# Altium project PCB_Project2.PrjPCB
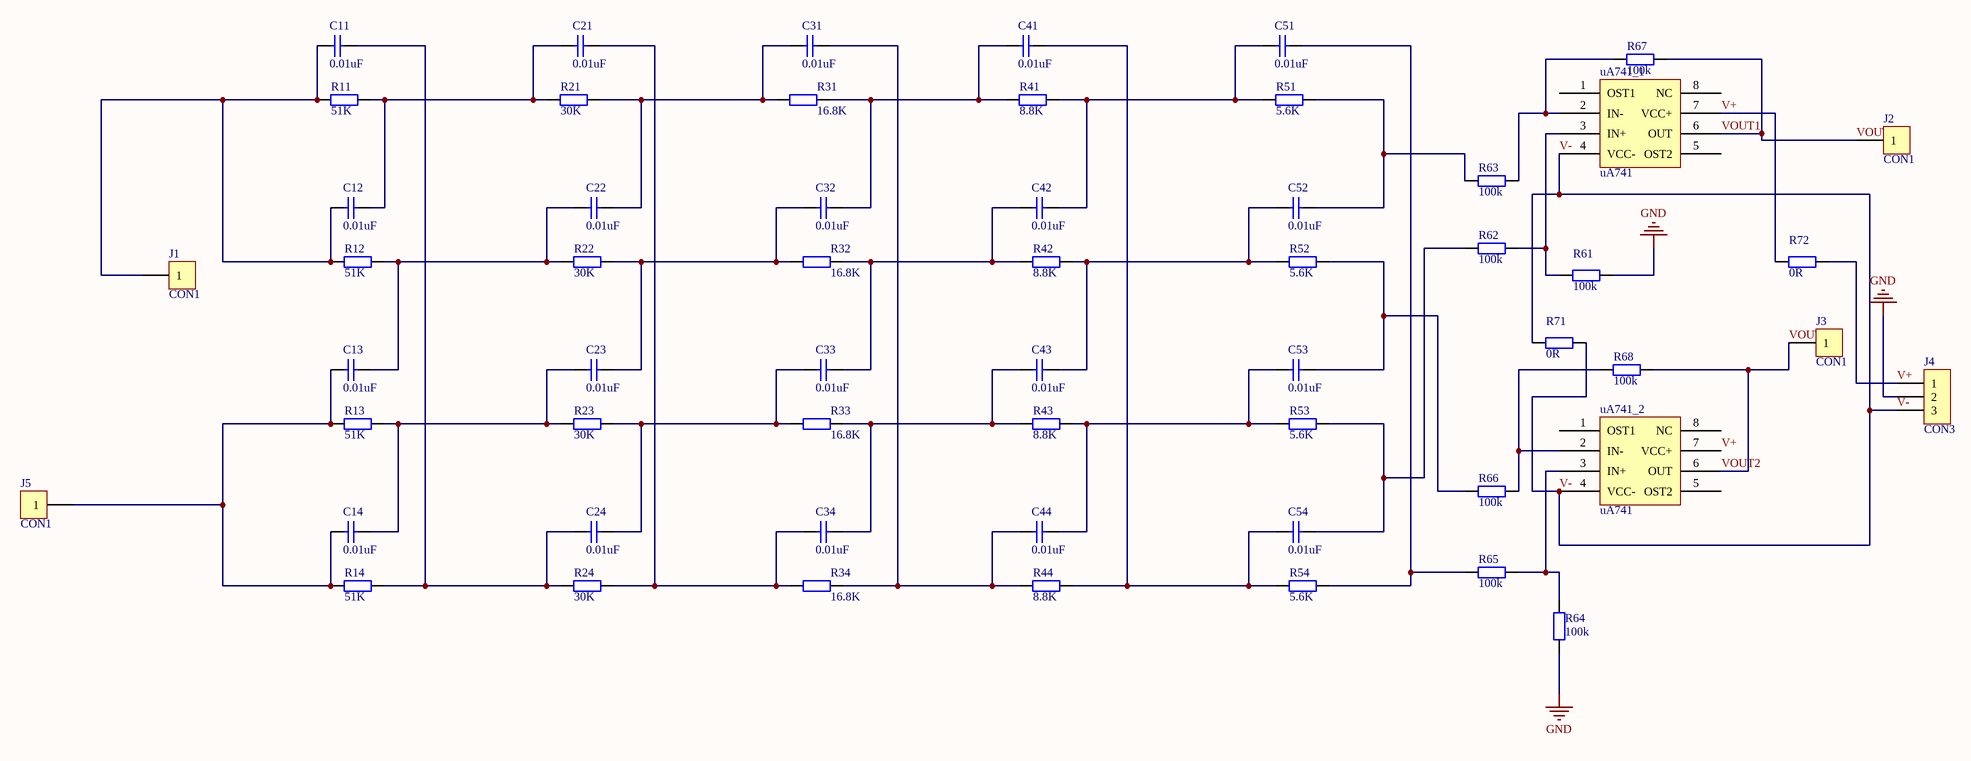
[diagram p0: Sheet1.SchDoc]
1 sheet, 57 parts. Net scope: global (net labels, ports and power ports of the same name join across sheets).
Board file: PCB1.PcbDoc

## Sheet Sheet1.SchDoc
size A3

### Parts
C11  0.01uF  [0603C]
C12  0.01uF  [0603C]
C13  0.01uF  [0603C]
C14  0.01uF  [0603C]
C21  0.01uF  [0603C]
C22  0.01uF  [0603C]
C23  0.01uF  [0603C]
C24  0.01uF  [0603C]
C31  0.01uF  [0603C]
C32  0.01uF  [0603C]
C33  0.01uF  [0603C]
C34  0.01uF  [0603C]
C41  0.01uF  [0603C]
C42  0.01uF  [0603C]
C43  0.01uF  [0603C]
C44  0.01uF  [0603C]
C51  0.01uF  [0603C]
C52  0.01uF  [0603C]
C53  0.01uF  [0603C]
C54  0.01uF  [0603C]
J1  CON1  [PIN-1-1.0]
J2  CON1  [PIN-1-1.0]
J3  CON1  [PIN-1-1.0]
J4  CON3  [PIN-3-2.54-1.0]
J5  CON1  [PIN-1-1.0]
R11  51K  [0603R]
R12  51K  [0603R]
R13  51K  [0603R]
R14  51K  [0603R]
R21  30K  [0603R]
R22  30K  [0603R]
R23  30K  [0603R]
R24  30K  [0603R]
R31  16.8K  [0603R]
R32  16.8K  [0603R]
R33  16.8K  [0603R]
R34  16.8K  [0603R]
R41  8.8K  [0603R]
R42  8.8K  [0603R]
R43  8.8K  [0603R]
R44  8.8K  [0603R]
R51  5.6K  [0603R]
R52  5.6K  [0603R]
R53  5.6K  [0603R]
R54  5.6K  [0603R]
R61  100k  [0603R]
R62  100k  [Inductor2]
R63  100k  [0603R]
R64  100k  [0603R]
R65  100k  [0603R]
R66  100k  [Inductor2]
R67  100k  [0603R]
R68  100k  [0603R]
R71  0R  [Inductor2]
R72  0R  [Inductor2]
uA741_1  uA741  [DIP-8]
uA741_2  uA741  [DIP-8]

### Nets
GND: J4.2 R61.1 R64.2
V+: J4.1 R72.1 R72.2 uA741_1.7(VCC+) uA741_2.7(VCC+)
V-: J4.3 R71.1 R71.2 uA741_1.4(VCC-) uA741_2.4(VCC-)
VOUT1: J2.1 R67.2 uA741_1.6(OUT)
VOUT2: J3.1 R68.2 uA741_2.6(OUT)
NetC11_1: C11.1 C12.1 J1.1 R11.1 R12.1
NetC11_2: C11.2 C24.1 R14.2 R24.1
NetC12_2: C12.2 C21.1 R11.2 R21.1
NetC13_1: C13.1 C14.1 J5.1 R13.1 R14.1
NetC13_2: C13.2 C22.1 R12.2 R22.1
NetC14_2: C14.2 C23.1 R13.2 R23.1
NetC21_2: C21.2 C34.1 R24.2 R34.1
NetC22_2: C22.2 C31.1 R21.2 R31.1
NetC23_2: C23.2 C32.1 R22.2 R32.1
NetC24_2: C24.2 C33.1 R23.2 R33.1
NetC31_2: C31.2 C44.1 R34.2 R44.1
NetC32_2: C32.2 C41.1 R31.2 R41.1
NetC33_2: C33.2 C42.1 R32.2 R42.1
NetC34_2: C34.2 C43.1 R33.2 R43.1
NetC41_2: C41.2 C54.1 R44.2 R54.2
NetC42_2: C42.2 C51.1 R41.2 R51.2
NetC43_2: C43.2 C52.1 R42.2 R52.2
NetC44_2: C44.2 C53.1 R43.2 R53.2
NetC51_2: C51.2 R54.1 R65.1
NetC52_2: C52.2 R51.1 R63.1
NetC53_2: C53.2 R52.1 R66.1
NetC54_2: C54.2 R53.1 R62.1
NetR61_2: R61.2 R62.2 uA741_1.3(IN+)
NetR63_2: R63.2 R67.1 uA741_1.2(IN-)
NetR64_1: R64.1 R65.2 uA741_2.3(IN+)
NetR66_2: R66.2 R68.1 uA741_2.2(IN-)

Not connected (* = marked no-connect by the designer): uA741_1 1(OST1) 5(OST2) 8(NC); uA741_2 1(OST1) 5(OST2) 8(NC)

### Library data of the parts
C11-C14 C21-C24 C31-C34 C41-C44 C51-C54 = Cap: Capacitor; Published: 8-Jun-2000; LatestRevisionDate: 17-Jul-2002; LatestRevisionNote: Re-released for DXP Platform.; PackageReference: RAD-0.3; Publisher: Altium Limited
R11-R14 R21-R24 R31-R34 R41-R44 R51-R54 = Res2: Resistor; Published: 8-Jun-2000; LatestRevisionDate: 17-Jul-2002; LatestRevisionNote: Re-released for DXP Platform.; PackageReference: AXIAL-0.4; Publisher: Altium Limited
R61-R68 R71 R72 = RES: Resistor